# Altium schematic sheet QSPI_FLASH.SchDoc
size A3; SheetNumber: 1; SheetTotal: 8
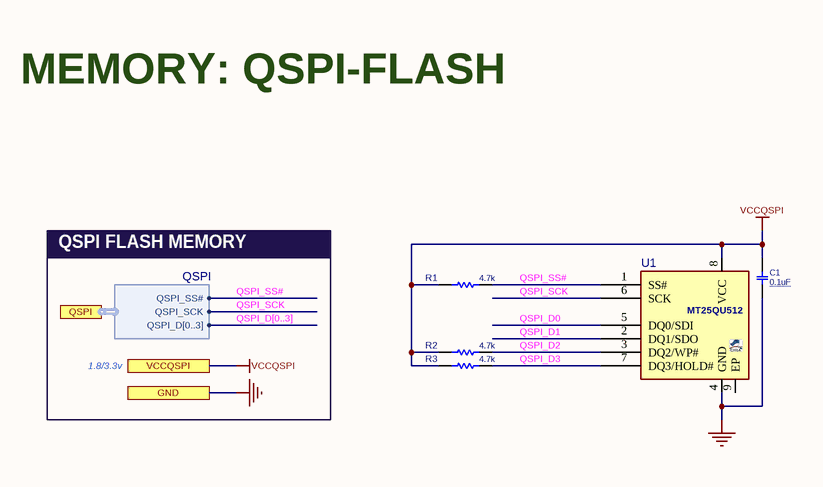
[diagram p0: QSPI_FLASH.SchDoc]

## Parts
C1  0.1uF  [C0402]
R1  4.7k  [R0402]
R2  4.7k  [R0402]
R3  4.7k  [R0402]
U1  MT25QU512  [SON127_8T_6080]

## Ports
GND, QSPI (harness QSPI), VCCQSPI

## Harnesses
QSPI: QSPI_SS#, QSPI_SCK, QSPI_D[0..3]

## Nets
GND: C1.2 U1.4(GND) ; port GND
VCCQSPI: C1.1 R1.1 R2.1 R3.1 U1.8(VCC) ; port VCCQSPI
QSPI_D0: U1.5(DQ0/SDI)
QSPI_D1: U1.2(DQ1/SDO)
QSPI_D2: R2.2 U1.3(DQ2/WP#)
QSPI_D3: R3.2 U1.7(DQ3/HOLD#)
QSPI_SCK: U1.6(SCK) ; port QSPI.QSPI_SCK
QSPI_SS#: R1.2 U1.1(SS#) ; port QSPI.QSPI_SS#

Not connected (* = marked no-connect by the designer): U1 9(EP)

## Buses and harness runs
bus QSPI_D[0..3]

## Notes on the sheet
- MEMORY: QSPI-FLASH
- QSPI FLASH MEMORY
- 1.8/3.3v

## Library data of the parts
C1 = CAP_SMD_MLCC: CAP, MLCC; DESC: CAP, MLCC, 1nF, 50V, C0G, 10%, 0402; MANF_P#: MANF_PART#; MANF: Murata; PARAM2: 50V; PARAM: -; PRICE: 100= 1$; ASSEMBLY: ASSEMBLY; VALUE: 0.1uF
R1-R3 = RES_SMD: RESISTOR, SMD; PARAM: -W; DESC: DESCRIPTION; DIST#: MOUSER; PARAM2: 1%; MANF_P#: -; MANF: -; ASSEMBLY: ASSEMBLY; PRICE: 100= 0.5$; VALUE: 4.7k
U1 = N25Q512_SON8: SPI FLASH Memory, 512Mb (128M x4), 108MHz; MANF: Micron; MANF_P#: MT25QU512ABB1EW9; PARAM2: 2.7~3.6V; PARAM: 512Mb (128M x4), 108MHz; VALUE: MT25QU512